# Altium schematic sheet FlashLight.SchDoc
size A; SheetNumber: 1; SheetTotal: 1
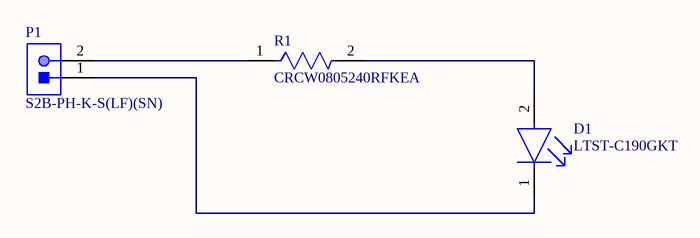
[diagram p0: FlashLight.SchDoc]

## Parts
D1  LTST-C190GKT  [FP-LTST-C190GKT-MFG]
P1  S2B-PH-K-S(LF)(SN)  [JST-S2B-PH-K-S_V]
R1  CRCW0805240RFKEA  [FP-CRCW0805-e3-MFG]

## Nets
NetD1_1: D1.1(C) P1.1
NetD1_2: D1.2(A) R1.2
NetP1_2: P1.2 R1.1

## Library data of the parts
D1 = CMP-22017-000005-2: LED GREEN CLEAR CHIP SMD; Dominant Wavelength: 569nm; Reverse Voltage: 5V; Lens Color: Colorless; Viewing Angle: 130°; Voltage: 2V; Forward Current: 30mA; Power Dissipation: 100mW; Luminous Intensity: 6mcd; Number of LEDs: 1; Forward Voltage: 2.1V; Wavelength: 565nm; Test Current: 10mA; Min Operating Temperature: -55°C; Lens Style: Clear; Mount: Surface Mount; Width: 0.8mm; Packaging: Tape and Reel; Lens Transparency: Clear; Case Code (Metric): 1608; Depth: 0.8mm; Case Code (Imperial): 0603; Case/Package: 0603; Number of Pins: 2; Max Operating Temperature: 85°C; Lead Free: Lead Free; Number of Elements: 1; Length: 1.6mm; Height: 0.8mm; Package Quantity: 1; Power Rating: 100mW; Radiation Hardening: No; Illumination Color: Green; Color: Green
P1 = CMP-1755-00004-1: Male Header, Pitch 2 mm, 1 x 2 Position, Height 4.8 mm, Tail Length 3.4 mm, -25 to 85 degC, RoHS, Bulk; Case\Package: Radial; Tolerance: 20%; Capacitance: 10 uF; Voltage Rating (DC): 50 V; Packaging: Bulk; ComponentLink1URL: http://www.jst-mfg.com/product/pdf/eng/ePH.pdf; Radiation Hardening: No; Height: 11 mm; Package Quantity: 200; PackageDescription: Male Header, Pitch 2 mm, 1 x 2 Position, Height 4.8 mm, Tail Length 3.4 mm; PackageReference: S2B-PH-K-S; Diameter: 5 mm; Pins: 2; Mount: Through Hole; Max Operating Temperature: 85 degC; Min Operating Temperature: -40 degC; ComponentLink1Description: Datasheet; DatasheetVersion: Dec-12; Length: 11 mm; Lead Pitch: 2 mm; REACH SVHC: No SVHC; Voltage Rating: 50 V; RoHSCompliant: true
R1 = CMP-2001-03705-2: RES Thick Film, 240Ω, 1%, 0.125W, 100ppm/°C, 0805; Resistance: 240R; Power Rating: 125mW; Voltage Rating: 150V; Temperature Coefficient: 100ppm/°C; Number of Terminations: 2; Case Code (Imperial): 0805; Case Code (Metric): 2012; Height: 0.45mm; Termination: SMD/SMT; Tolerance: 1%; Width: 0.049inch; Packaging: Tape and Reel; Max Operating Temperature: 155°C; Case/Package: 0805; Voltage Rating (DC): 150V; Length: 2mm; Radiation Hardening: No; Lead Free: Lead Free; Contact Plating: Tin; Features: Automotive AEC-Q200; Composition: Thick Film; Package Quantity: 10; Max Power Dissipation: 125mW; Military Standard: Not; Weight: 0.000194oz; Depth: 1.25mm; Min Operating Temperature: -55°C